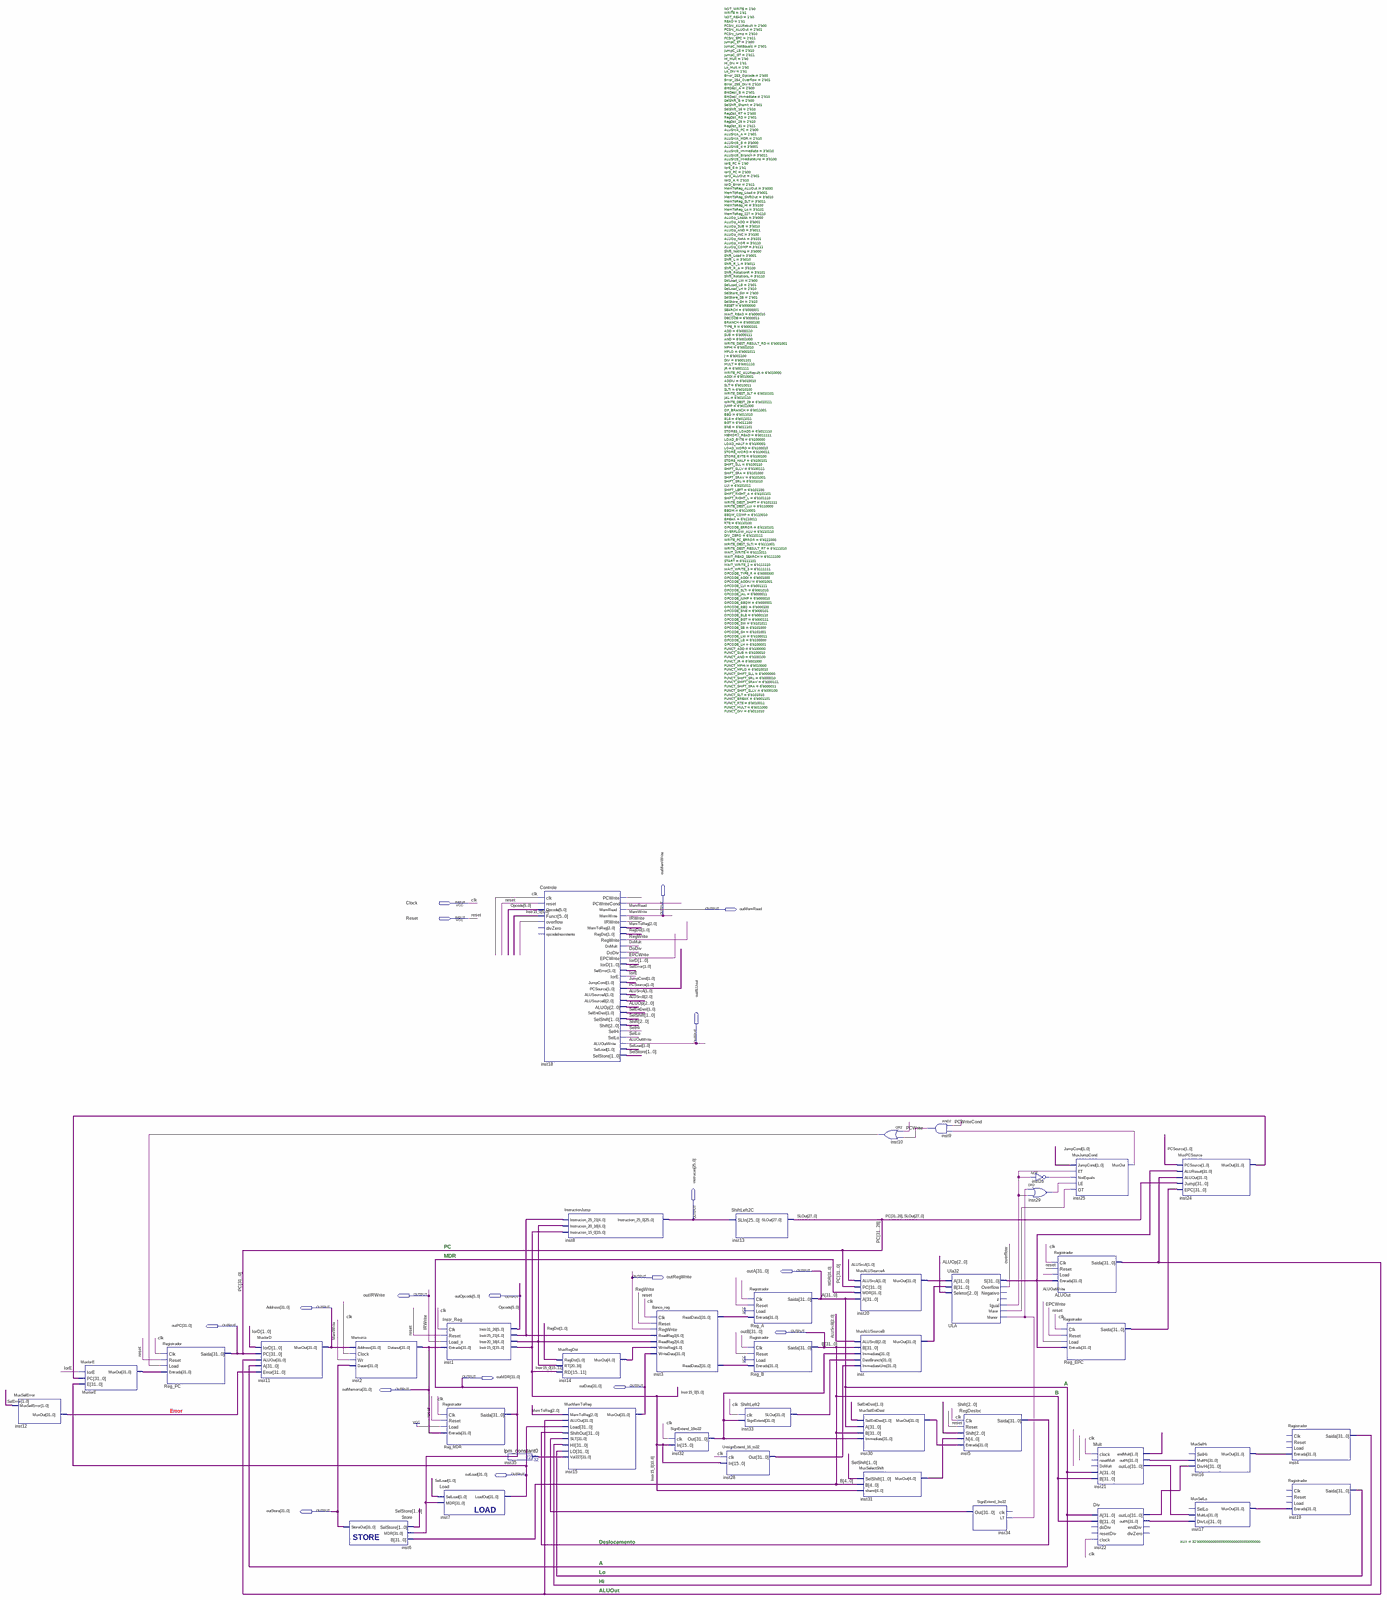
[diagram p0: schematic sheet, whole]
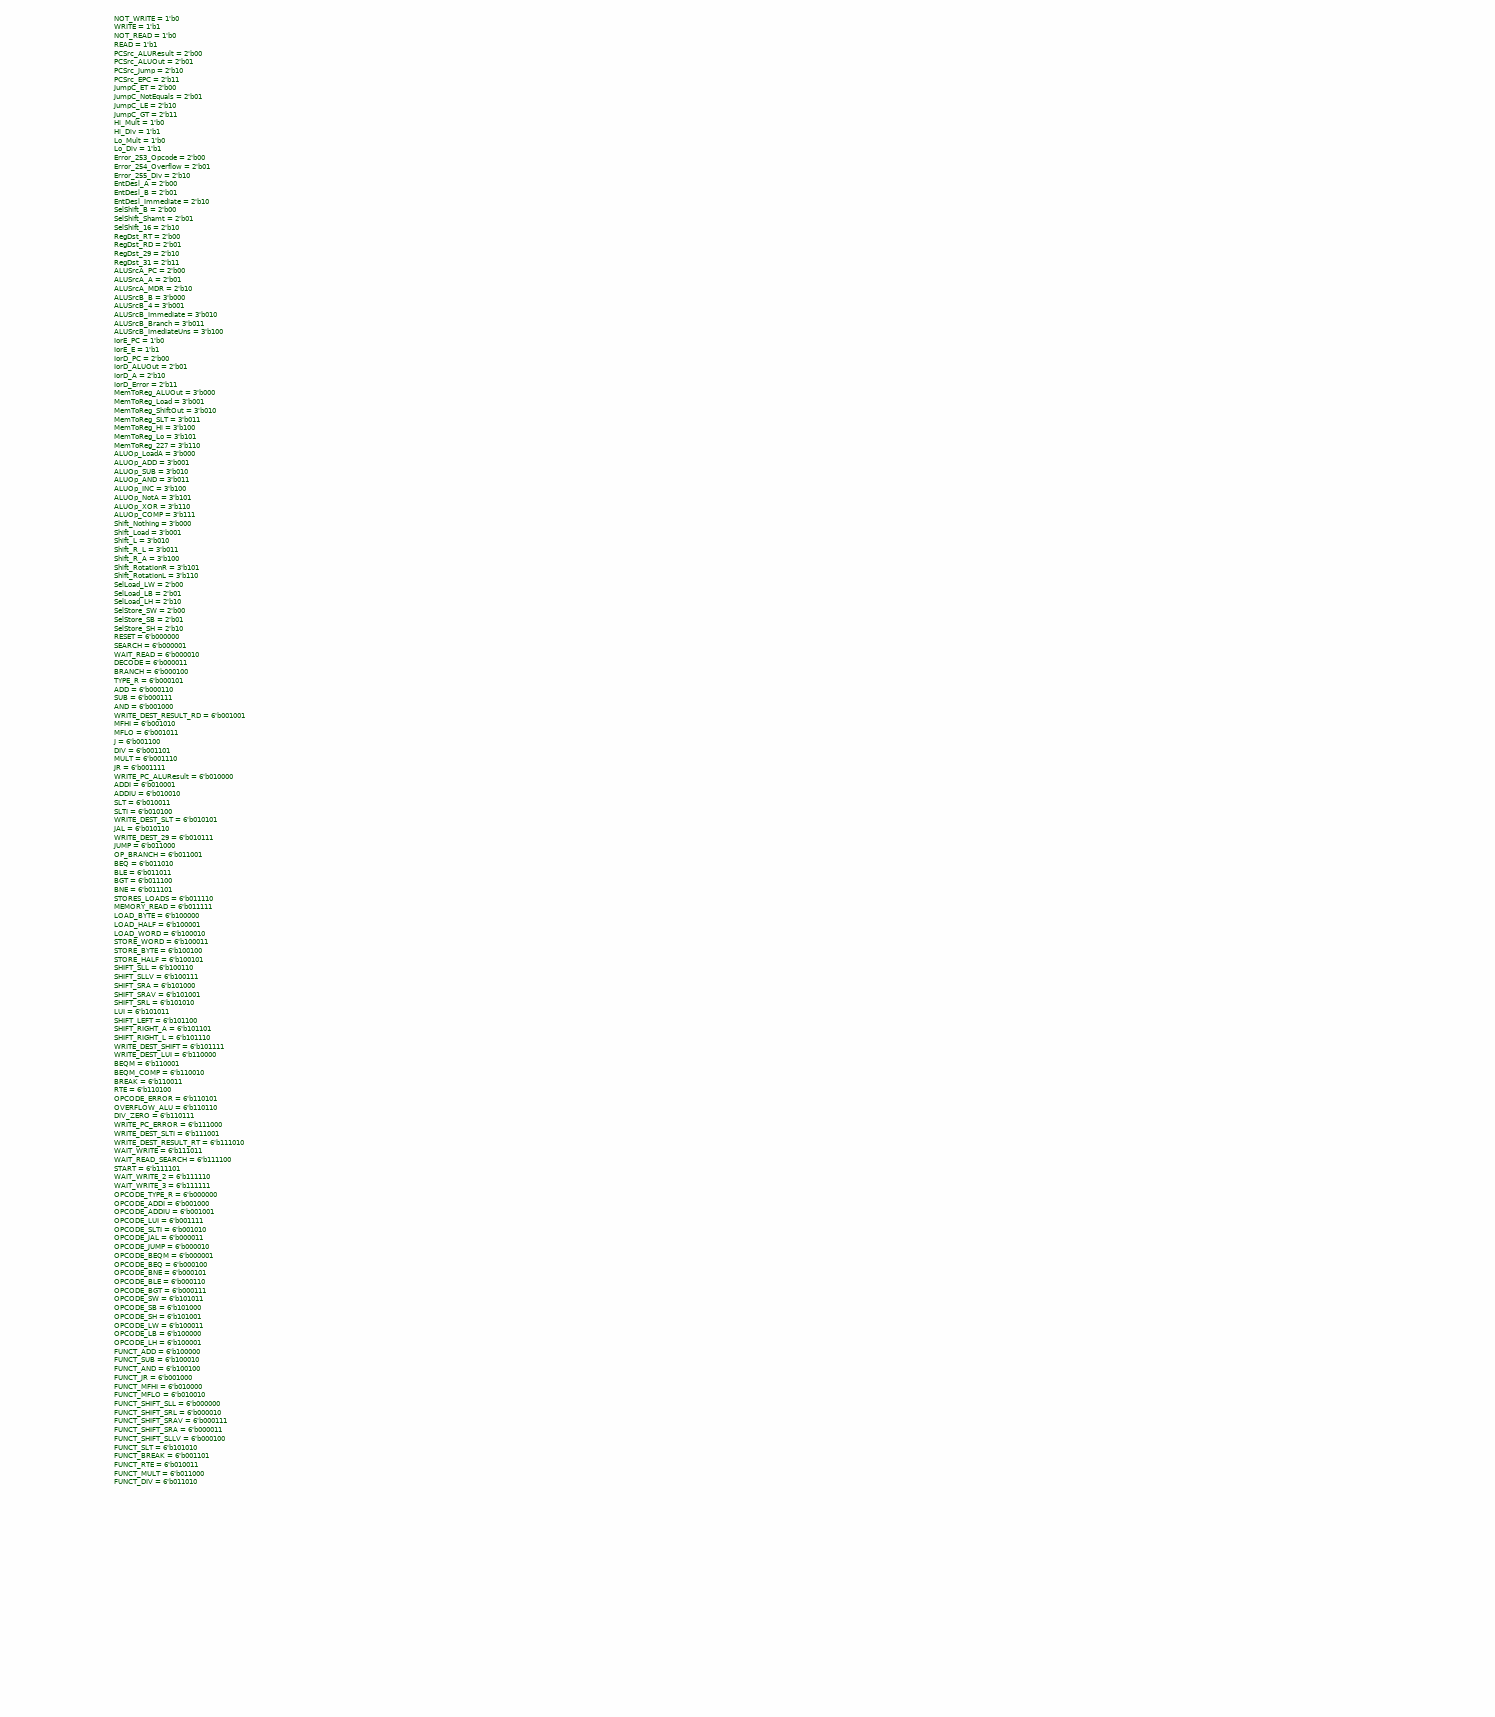
[diagram p1: schematic sheet, upper right part]
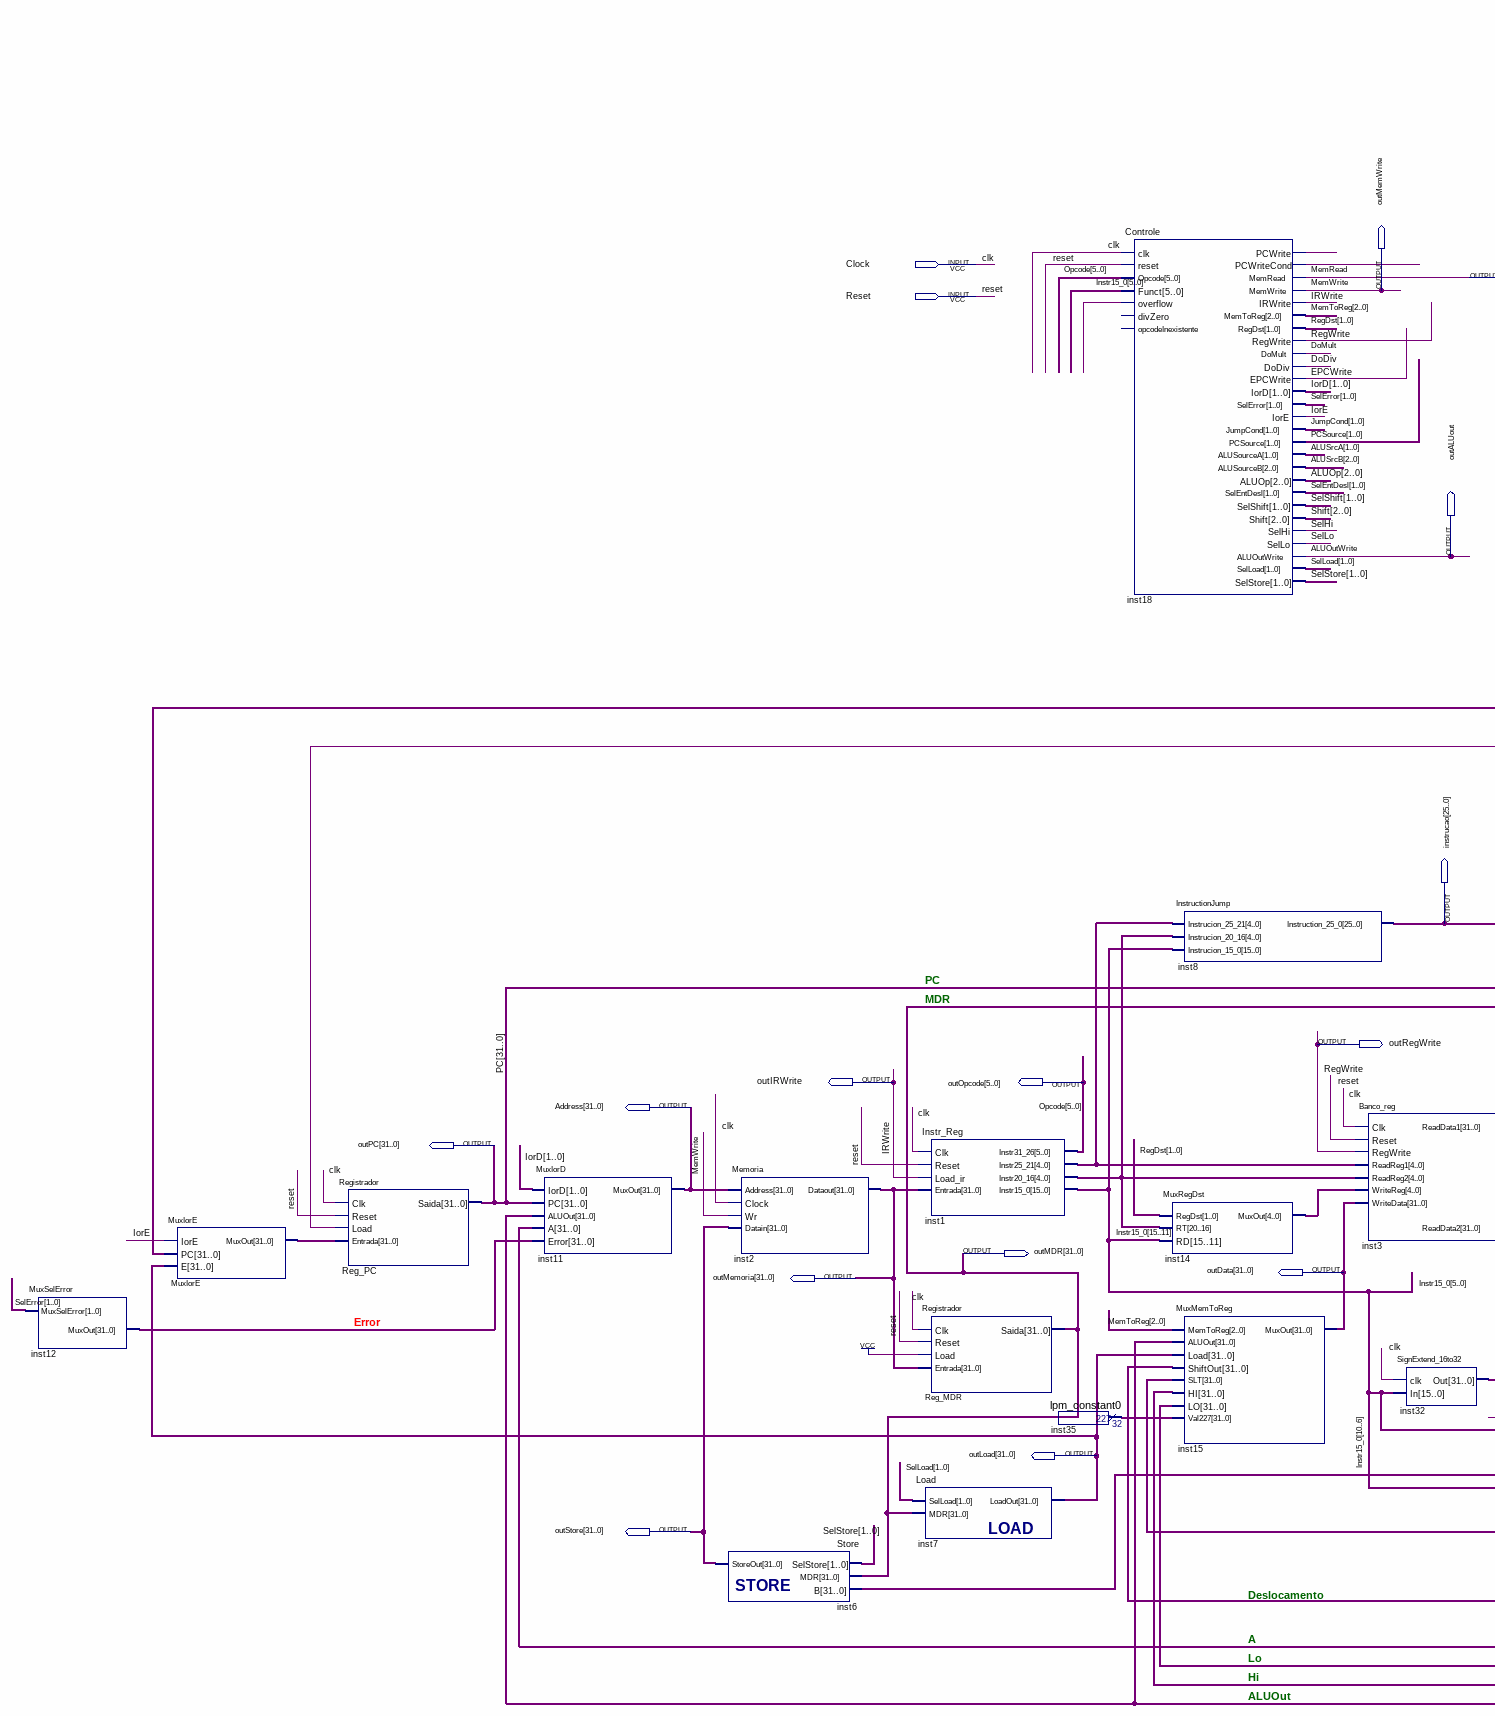
[diagram p2: schematic sheet, lower left part]
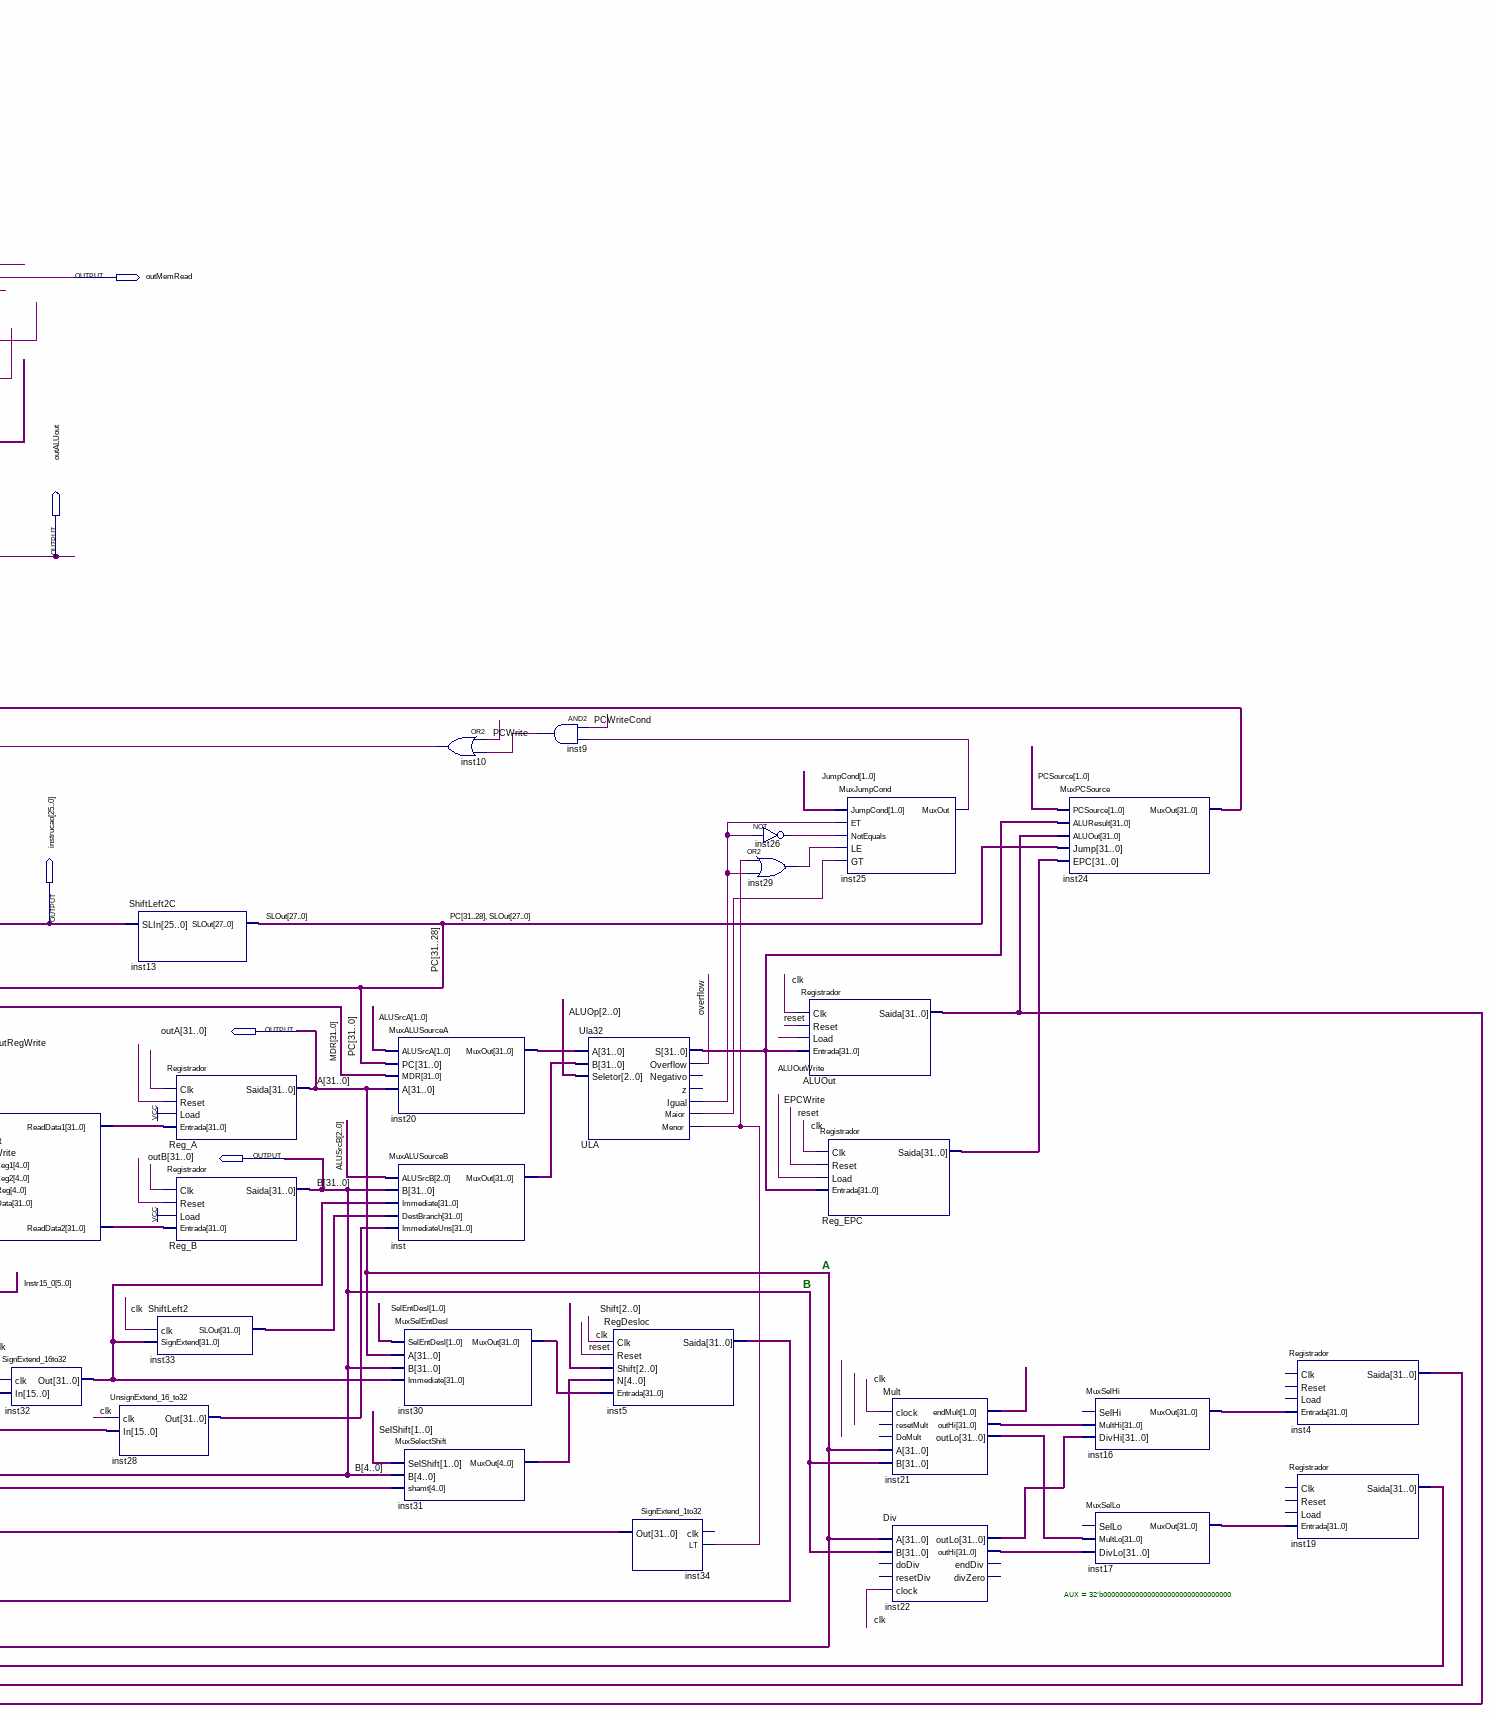
[diagram p3: schematic sheet, lower right part]
// Quartus schematic arquitetura.bdf as structural Verilog: 42 symbols, 18 pins
module arquitetura (
  input  Clock,
  input  Reset,
  output outMemRead,
  output outMemWrite,
  output outALUout,
  output [25:0] instrucao,
  output [31:0] outA,
  output outRegWrite,
  output outIRWrite,
  output [5:0] outOpcode,
  output [31:0] Address,
  output [31:0] outPC,
  output [31:0] outB,
  output [31:0] outMDR,
  output [31:0] outData,
  output [31:0] outMemoria,
  output [31:0] outLoad,
  output [31:0] outStore
);

  wire DoDiv, DoMult, EPCWrite, inst9_out, inst10_out, inst25_muxout, inst26_out, inst29_out, IorE, overflow,
       PCWrite, PCWriteCond, SelHi, SelLo, ULA_igual, ULA_maior, ULA_menor;
  wire [1:0] ALUSrcA, inst21_endmult, IorD, JumpCond, PCSource, RegDst, SelEntDesl, SelError, SelLoad,
       SelShift, SelStore;
  wire [2:0] ALUOp, ALUSrcB, MemToReg, Shift;
  wire [4:0] inst14_muxout, Inst20_16, inst31_muxout, Instr25_21;
  wire [15:0] Instr15_0;
  wire [27:0] SLOut;
  wire [31:0] ALUOut_saida, inst3_readdata1, inst3_readdata2, inst4_saida, inst5_saida, inst12_muxout,
       inst16_muxout, inst17_muxout, inst19_saida, inst20_muxout, inst21_outhi, inst21_outlo, inst22_outhi,
       inst22_outlo, inst24_muxout, inst28_out, inst30_muxout, inst32_out, inst33_slout, inst34_out,
       inst35_result, inst_muxout, MuxIorE_muxout, Reg_EPC_saida, ULA_s;

  MuxSelError inst12 (.MuxSelError(SelError), .MuxOut(inst12_muxout));
  MuxIorE MuxIorE (.IorE(IorE), .PC(inst24_muxout), .E(outLoad), .MuxOut(MuxIorE_muxout));
  Registrador Reg_PC (.Clk(Clock), .Reset(Reset), .Load(inst10_out), .Entrada(MuxIorE_muxout), .Saida(outPC));
  MuxIorD inst11 (.IorD(IorD), .PC(outPC), .ALUOut(ALUOut_saida), .A(outA), .Error(inst12_muxout), .MuxOut(Address));
  Store inst6 (.SelStore(SelStore), .MDR(outMDR), .B(outB), .StoreOut(outStore));
  Memoria inst2 (.Address(Address), .Clock(Clock), .Wr(outMemWrite), .Datain(outStore), .Dataout(outMemoria));
  Instr_Reg inst1 (
    .Clk(Clock), .Reset(Reset), .Load_ir(outIRWrite), .Entrada(outMemoria), .Instr31_26(outOpcode),
    .Instr25_21(Instr25_21), .Instr20_16(Inst20_16), .Instr15_0(Instr15_0));
  Registrador Reg_MDR (.Clk(Clock), .Reset(Reset), .Load(1'b1), .Entrada(outMemoria), .Saida(outMDR));
  Load inst7 (.SelLoad(SelLoad), .MDR(outMDR), .LoadOut(outLoad));
  lpm_constant0 inst35 (.result(inst35_result));
  Controle #(.NOT_WRITE(1'b0), .WRITE(1'b1), .NOT_READ(1'b0), .READ(1'b1), .PCSrc_ALUResult(2'b00), .PCSrc_ALUOut(2'b01), .PCSrc_Jump(2'b10), .PCSrc_EPC(2'b11), .JumpC_ET(2'b00), .JumpC_NotEquals(2'b01), .JumpC_LE(2'b10), .JumpC_GT(2'b11), .Hi_Mult(1'b0), .Hi_Div(1'b1), .Lo_Mult(1'b0), .Lo_Div(1'b1), .Error_253_Opcode(2'b00), .Error_254_Overflow(2'b01), .Error_255_Div(2'b10), .EntDesl_A(2'b00), .EntDesl_B(2'b01), .EntDesl_Immediate(2'b10), .SelShift_B(2'b00), .SelShift_Shamt(2'b01), .SelShift_16(2'b10), .RegDst_RT(2'b00), .RegDst_RD(2'b01), .RegDst_29(2'b10), .RegDst_31(2'b11), .ALUSrcA_PC(2'b00), .ALUSrcA_A(2'b01), .ALUSrcA_MDR(2'b10), .ALUSrcB_B(3'b000), .ALUSrcB_4(3'b001), .ALUSrcB_Immediate(3'b010), .ALUSrcB_Branch(3'b011), .ALUSrcB_ImediateUns(3'b100), .IorE_PC(1'b0), .IorE_E(1'b1), .IorD_PC(2'b00), .IorD_ALUOut(2'b01), .IorD_A(2'b10), .IorD_Error(2'b11), .MemToReg_ALUOut(3'b000), .MemToReg_Load(3'b001), .MemToReg_ShiftOut(3'b010), .MemToReg_SLT(3'b011), .MemToReg_Hi(3'b100), .MemToReg_Lo(3'b101), .MemToReg_227(3'b110), .ALUOp_LoadA(3'b000), .ALUOp_ADD(3'b001), .ALUOp_SUB(3'b010), .ALUOp_AND(3'b011), .ALUOp_INC(3'b100), .ALUOp_NotA(3'b101), .ALUOp_XOR(3'b110), .ALUOp_COMP(3'b111), .Shift_Nothing(3'b000), .Shift_Load(3'b001), .Shift_L(3'b010), .Shift_R_L(3'b011), .Shift_R_A(3'b100), .Shift_RotationR(3'b101), .Shift_RotationL(3'b110), .SelLoad_LW(2'b00), .SelLoad_LB(2'b01), .SelLoad_LH(2'b10), .SelStore_SW(2'b00), .SelStore_SB(2'b01), .SelStore_SH(2'b10), .RESET(6'b000000), .SEARCH(6'b000001), .WAIT_READ(6'b000010), .DECODE(6'b000011), .BRANCH(6'b000100), .TYPE_R(6'b000101), .ADD(6'b000110), .SUB(6'b000111), .AND(6'b001000), .WRITE_DEST_RESULT_RD(6'b001001), .MFHI(6'b001010), .MFLO(6'b001011), .J(6'b001100), .DIV(6'b001101), .MULT(6'b001110), .JR(6'b001111), .WRITE_PC_ALUResult(6'b010000), .ADDI(6'b010001), .ADDIU(6'b010010), .SLT(6'b010011), .SLTI(6'b010100), .WRITE_DEST_SLT(6'b010101), .JAL(6'b010110), .WRITE_DEST_29(6'b010111), .JUMP(6'b011000), .OP_BRANCH(6'b011001), .BEQ(6'b011010), .BLE(6'b011011), .BGT(6'b011100), .BNE(6'b011101), .STORES_LOADS(6'b011110), .MEMORY_READ(6'b011111), .LOAD_BYTE(6'b100000), .LOAD_HALF(6'b100001), .LOAD_WORD(6'b100010), .STORE_WORD(6'b100011), .STORE_BYTE(6'b100100), .STORE_HALF(6'b100101), .SHIFT_SLL(6'b100110), .SHIFT_SLLV(6'b100111), .SHIFT_SRA(6'b101000), .SHIFT_SRAV(6'b101001), .SHIFT_SRL(6'b101010), .LUI(6'b101011), .SHIFT_LEFT(6'b101100), .SHIFT_RIGHT_A(6'b101101), .SHIFT_RIGHT_L(6'b101110), .WRITE_DEST_SHIFT(6'b101111), .WRITE_DEST_LUI(6'b110000), .BEQM(6'b110001), .BEQM_COMP(6'b110010), .BREAK(6'b110011), .RTE(6'b110100), .OPCODE_ERROR(6'b110101), .OVERFLOW_ALU(6'b110110), .DIV_ZERO(6'b110111), .WRITE_PC_ERROR(6'b111000), .WRITE_DEST_SLTI(6'b111001), .WRITE_DEST_RESULT_RT(6'b111010), .WAIT_WRITE(6'b111011), .WAIT_READ_SEARCH(6'b111100), .START(6'b111101), .WAIT_WRITE_2(6'b111110), .WAIT_WRITE_3(6'b111111), .OPCODE_TYPE_R(6'b000000), .OPCODE_ADDI(6'b001000), .OPCODE_ADDIU(6'b001001), .OPCODE_LUI(6'b001111), .OPCODE_SLTI(6'b001010), .OPCODE_JAL(6'b000011), .OPCODE_JUMP(6'b000010), .OPCODE_BEQM(6'b000001), .OPCODE_BEQ(6'b000100), .OPCODE_BNE(6'b000101), .OPCODE_BLE(6'b000110), .OPCODE_BGT(6'b000111), .OPCODE_SW(6'b101011), .OPCODE_SB(6'b101000), .OPCODE_SH(6'b101001), .OPCODE_LW(6'b100011), .OPCODE_LB(6'b100000), .OPCODE_LH(6'b100001), .FUNCT_ADD(6'b100000), .FUNCT_SUB(6'b100010), .FUNCT_AND(6'b100100), .FUNCT_JR(6'b001000), .FUNCT_MFHI(6'b010000), .FUNCT_MFLO(6'b010010), .FUNCT_SHIFT_SLL(6'b000000), .FUNCT_SHIFT_SRL(6'b000010), .FUNCT_SHIFT_SRAV(6'b000111), .FUNCT_SHIFT_SRA(6'b000011), .FUNCT_SHIFT_SLLV(6'b000100), .FUNCT_SLT(6'b101010), .FUNCT_BREAK(6'b001101), .FUNCT_RTE(6'b010011), .FUNCT_MULT(6'b011000), .FUNCT_DIV(6'b011010)) inst18 (
    .clk(Clock), .reset(Reset), .Opcode(outOpcode), .Funct(Instr15_0[5:0]), .overflow(overflow),
    .PCWrite(PCWrite), .PCWriteCond(PCWriteCond), .MemRead(outMemRead), .MemWrite(outMemWrite),
    .IRWrite(outIRWrite), .MemToReg(MemToReg), .RegDst(RegDst), .RegWrite(outRegWrite), .DoMult(DoMult),
    .DoDiv(DoDiv), .EPCWrite(EPCWrite), .IorD(IorD), .SelError(SelError), .IorE(IorE), .JumpCond(JumpCond),
    .PCSource(PCSource), .ALUSourceA(ALUSrcA), .ALUSourceB(ALUSrcB), .ALUOp(ALUOp), .SelEntDesl(SelEntDesl),
    .SelShift(SelShift), .Shift(Shift), .SelHi(SelHi), .SelLo(SelLo), .ALUOutWrite(outALUout),
    .SelLoad(SelLoad), .SelStore(SelStore));  // open: divZero, opcodeInexistente
  InstructionJump inst8 (
    .Instrucion_25_21(Instr25_21), .Instrucion_20_16(Inst20_16), .Instrucion_15_0(Instr15_0),
    .Instruction_25_0(instrucao));
  MuxRegDst inst14 (.RegDst(RegDst), .RT(Inst20_16), .RD(Instr15_0[15:11]), .MuxOut(inst14_muxout));
  MuxMemToReg inst15 (
    .MemToReg(MemToReg), .ALUOut(ALUOut_saida), .Load(outLoad), .ShiftOut(inst5_saida), .SLT(inst34_out),
    .HI(inst4_saida), .LO(inst19_saida), .Val227(inst35_result), .MuxOut(outData));
  Banco_reg inst3 (
    .Clk(Clock), .Reset(Reset), .RegWrite(outRegWrite), .ReadReg1(Instr25_21), .ReadReg2(Inst20_16),
    .WriteReg(inst14_muxout), .WriteData(outData), .ReadData1(inst3_readdata1), .ReadData2(inst3_readdata2));
  SignExtend_16to32 inst32 (.clk(Clock), .In(Instr15_0), .Out(inst32_out));
  ShiftLeft2C inst13 (.SLIn(instrucao), .SLOut(SLOut));
  UnsignExtend_16_to32 inst28 (.clk(Clock), .In(Instr15_0), .Out(inst28_out));
  Registrador Reg_A (.Clk(Clock), .Reset(Reset), .Load(1'b1), .Entrada(inst3_readdata1), .Saida(outA));
  Registrador Reg_B (.Clk(Clock), .Reset(Reset), .Load(1'b1), .Entrada(inst3_readdata2), .Saida(outB));
  ShiftLeft2 inst33 (.clk(Clock), .SignExtend(inst32_out), .SLOut(inst33_slout));
  MuxALUSourceA inst20 (.ALUSrcA(ALUSrcA), .PC(outPC), .MDR(outMDR), .A(outA), .MuxOut(inst20_muxout));
  MuxALUSourceB inst (
    .ALUSrcB(ALUSrcB), .B(outB), .Immediate(inst32_out), .DestBranch(inst33_slout),
    .ImmediateUns(inst28_out), .MuxOut(inst_muxout));
  or inst10 (inst10_out, PCWrite, inst9_out);
  MuxSelEntDesl inst30 (.SelEntDesl(SelEntDesl), .A(outA), .B(outB), .Immediate(inst32_out), .MuxOut(inst30_muxout));
  MuxSelectShift inst31 (.SelShift(SelShift), .B(outB[4:0]), .shamt(Instr15_0[10:6]), .MuxOut(inst31_muxout));
  and inst9 (inst9_out, PCWriteCond, inst25_muxout);
  Ula32 ULA (
    .A(inst20_muxout), .B(inst_muxout), .Seletor(ALUOp), .S(ULA_s), .Overflow(overflow), .Igual(ULA_igual),
    .Maior(ULA_maior), .Menor(ULA_menor));  // open: Negativo, z
  RegDesloc inst5 (
    .Clk(Clock), .Reset(Reset), .Shift(Shift), .N(inst31_muxout), .Entrada(inst30_muxout), .Saida(inst5_saida));
  SignExtend_1to32 inst34 (.LT(ULA_menor), .Out(inst34_out));  // open: clk
  not inst26 (inst26_out, ULA_igual);
  or inst29 (inst29_out, ULA_menor, ULA_igual);
  MuxJumpCond inst25 (
    .JumpCond(JumpCond), .ET(ULA_igual), .NotEquals(inst26_out), .LE(inst29_out), .GT(ULA_maior),
    .MuxOut(inst25_muxout));
  Registrador ALUOut (.Clk(Clock), .Reset(Reset), .Load(outALUout), .Entrada(ULA_s), .Saida(ALUOut_saida));
  Registrador Reg_EPC (.Clk(Clock), .Reset(Reset), .Load(EPCWrite), .Entrada(ULA_s), .Saida(Reg_EPC_saida));
  Mult inst21 (
    .clock(Clock), .A(outA), .B(outB), .endMult(inst21_endmult), .outHi(inst21_outhi), .outLo(inst21_outlo));  // open: resetMult, DoMult
  Div #(.AUX(32'b00000000000000000000000000000000)) inst22 (
    .A(outA), .B(outB), .clock(Clock), .outLo(inst22_outlo), .outHi(inst22_outhi));  // open: doDiv, resetDiv, endDiv, divZero
  MuxPCSource inst24 (
    .PCSource(PCSource), .ALUResult(ULA_s), .ALUOut(ALUOut_saida), .Jump({outPC[31:28], SLOut}),
    .EPC(Reg_EPC_saida), .MuxOut(inst24_muxout));
  MuxSelHi inst16 (.MultHi(inst21_outhi), .DivHi(inst22_outlo), .MuxOut(inst16_muxout));  // open: SelHi
  MuxSelLo inst17 (.MultLo(inst21_outlo), .DivLo(inst22_outhi), .MuxOut(inst17_muxout));  // open: SelLo
  Registrador inst4 (.Entrada(inst16_muxout), .Saida(inst4_saida));  // open: Clk, Reset, Load
  Registrador inst19 (.Entrada(inst17_muxout), .Saida(inst19_saida));  // open: Clk, Reset, Load

  // Other names for the same wires on the sheet: ALUOutWrite = outALUout; clk = Clock; MemRead = outMemRead;
  //   MemWrite = outMemWrite; Opcode[5:0] = outOpcode; A[31:0] = outA; B[31:0] = outB; IRWrite = outIRWrite;
  //   MDR[31:0] = outMDR; PC[31:0] = outPC; RegWrite = outRegWrite

  // Notes on the sheet:
  //   PC
  //   MDR
  //   A
  //   B
  //   Error
  //   Deslocamento
  //   A
  //   Lo
  //   Hi
  //   ALUOut
endmodule
